# Altium schematic sheet Sheet1.SchDoc
size A4; SheetNumber: 1; SheetTotal: 1
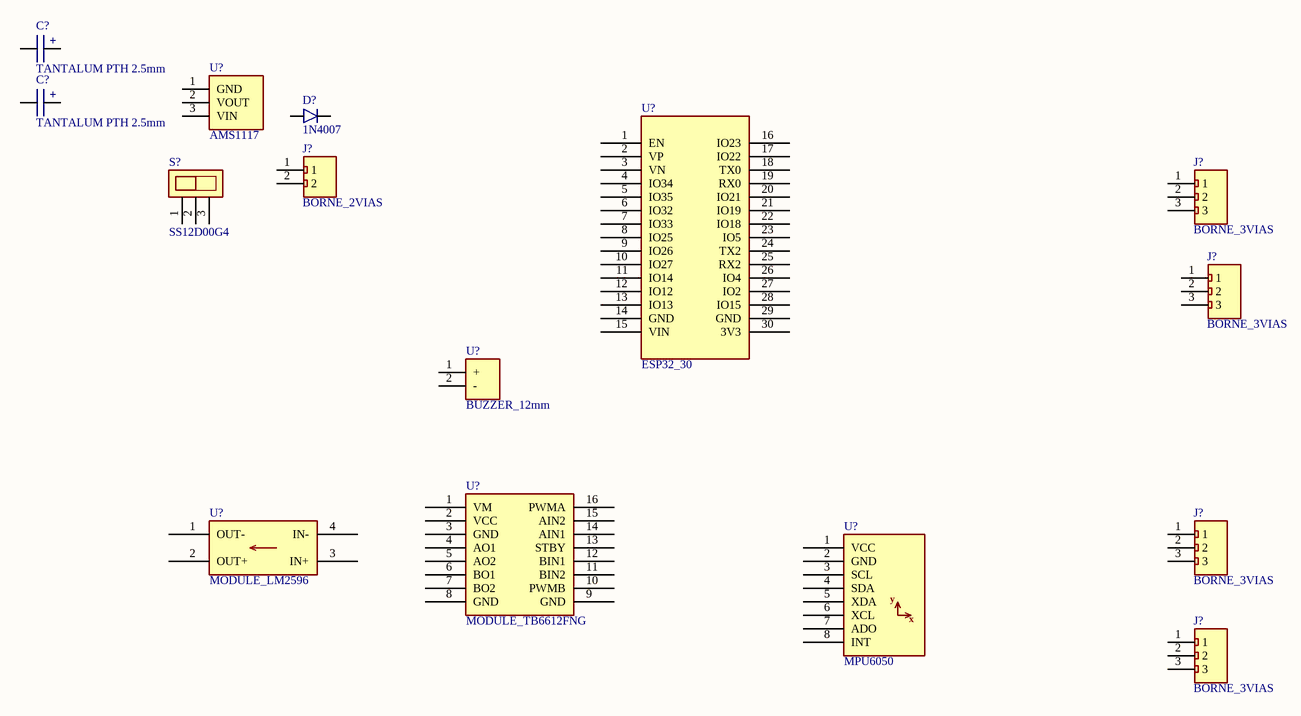
[diagram p0: Sheet1.SchDoc]

## Parts
(Parts that share a designator on the sheet are numbered #1, #2 ... from top to bottom, then left to right.)
C?#1  TANTALUM PTH 2.5mm  [TANTALUM PTH 2.5mm]
C?#2  TANTALUM PTH 2.5mm  [TANTALUM PTH 2.5mm]
D?  1N4007  [1n4007]
J?#1  BORNE_2VIAS  [BORNE_2_VIAS]
J?#2  BORNE_3VIAS  [BORNE_3_VIAS]
J?#3  BORNE_3VIAS  [BORNE_3_VIAS]
J?#4  BORNE_3VIAS  [BORNE_3_VIAS]
J?#5  BORNE_3VIAS  [BORNE_3_VIAS]
S?  SS12D00G4  [SS12D00G4]
U?#1  AMS1117  [AMS1117]
U?#2  ESP32_30  [ESP32_30]
U?#3  BUZZER_12mm  [BUZZER_12mm]
U?#4  MODULE_LM2596  [MODULE_LM2596]
U?#5  MODULE_TB6612FNG  [MODULE_TB6612FNG]
U?#6  MPU6050  [MPU6050]

## Nets

Not connected (* = marked no-connect by the designer): C?#1 1 2; C?#2 1 2; D? 1 2(_); J?#1 1 2; J?#2 1 2 3; J?#3 1 2 3; J?#4 1 2 3; J?#5 1 2 3; S? 1 2 3; U?#1 1(GND) 2(VOUT) 3(VIN); U?#2 1(EN) 2(VP) 3(VN) 4(IO34) 5(IO35) 6(IO32) 7(IO33) 8(IO25) 9(IO26) 10(IO27) 11(IO14) 12(IO12) 13(IO13) 14(GND) 15(VIN) 16(IO23) 17(IO22) 18(TX0) 19(RX0) 20(IO21) 21(IO19) 22(IO18) 23(IO5) 24(TX2) 25(RX2) 26(IO4) 27(IO2) 28(IO15) 29(GND) 30(3V3); U?#3 1(+) 2(-); U?#4 1(OUT-) 2(OUT+) 3(IN+) 4(IN-); U?#5 1(VM) 2(VCC) 3(GND) 4(AO1) 5(AO2) 6(BO1) 7(BO2) 8(GND) 9(GND) 10(PWMB) 11(BIN2) 12(BIN1) 13(STBY) 14(AIN1) 15(AIN2) 16(PWMA); U?#6 1(VCC) 2(GND) 3(SCL) 4(SDA) 5(XDA) 6(XCL) 7(ADO) 8(INT)

## Notes on the sheet
- (in symbol MPU6050) y; x
- (in symbol TANTALUM PTH 2.5mm) +

## Library data of the parts
D? = 1N4007: Rectifier Diode 1000V 1A DO-41 10mm; Mouser PN: 637-1N4007; ComponentLink1Description: Datasheet; ComponentLink1URL: https://www.mouser.com/datasheet/2/849/1n4001-2577232.pdf; Digikey PN: 4617-1N4007TB-ND
U?#1 = AMS1117: IC REG LINEAR 1A SOT-89-3L; ComponentLink1Description: Datasheet; ComponentLink1URL: http://www.advanced-monolithic.com/pdf/ds1117.pdf; Digikey PN: 4518-AMS1117-3.3CT-ND
U?#2 = ESP32_30: Microcontoller Board 30 Pins Wifi 2.4GHz BLE 4.2 ESP32-WROOM-32D; ComponentLink1Description: Datasheet; ComponentLink1URL: https://www.mouser.com/datasheet/2/891/esp32_wroom_32d_esp32_wroom_32u_datasheet_en-1365844.pdf
U?#3 = BUZZER_12mm: BUZZER MAGNETIC 12MM; Digikey PN: 433-WT-1209T-ND; Mouser PN: 433-WT-1209T-ND
U?#4 = MODULE_LM2596: MODULE BUCK STEP DOWN 3A 43x20mm; ComponentLink1Description: Datasheet; ComponentLink1URL: https://www.ti.com/lit/ds/symlink/lm2596.pdf
U?#5 = MODULE_TB6612FNG: Module Dual Motor Driver 2.5-13.5V 3.2A Peak 21x18mm; ComponentLink1Description: Datasheet; ComponentLink1URL: https://www.mouser.com/datasheet/2/408/TB6612FNG_datasheet_en_20141001-708260.pdf
U?#6 = MPU6050: IMU ACCEL/GYRO 3-AXIS I2C; ComponentLink1Description: Datasheet; ComponentLink1URL: https://invensense.tdk.com/wp-content/uploads/2015/02/MPU-6000-Datasheet1.pdf